# Altium schematic sheet USB.SchDoc
size A; SheetNumber: 2; SheetTotal: 13
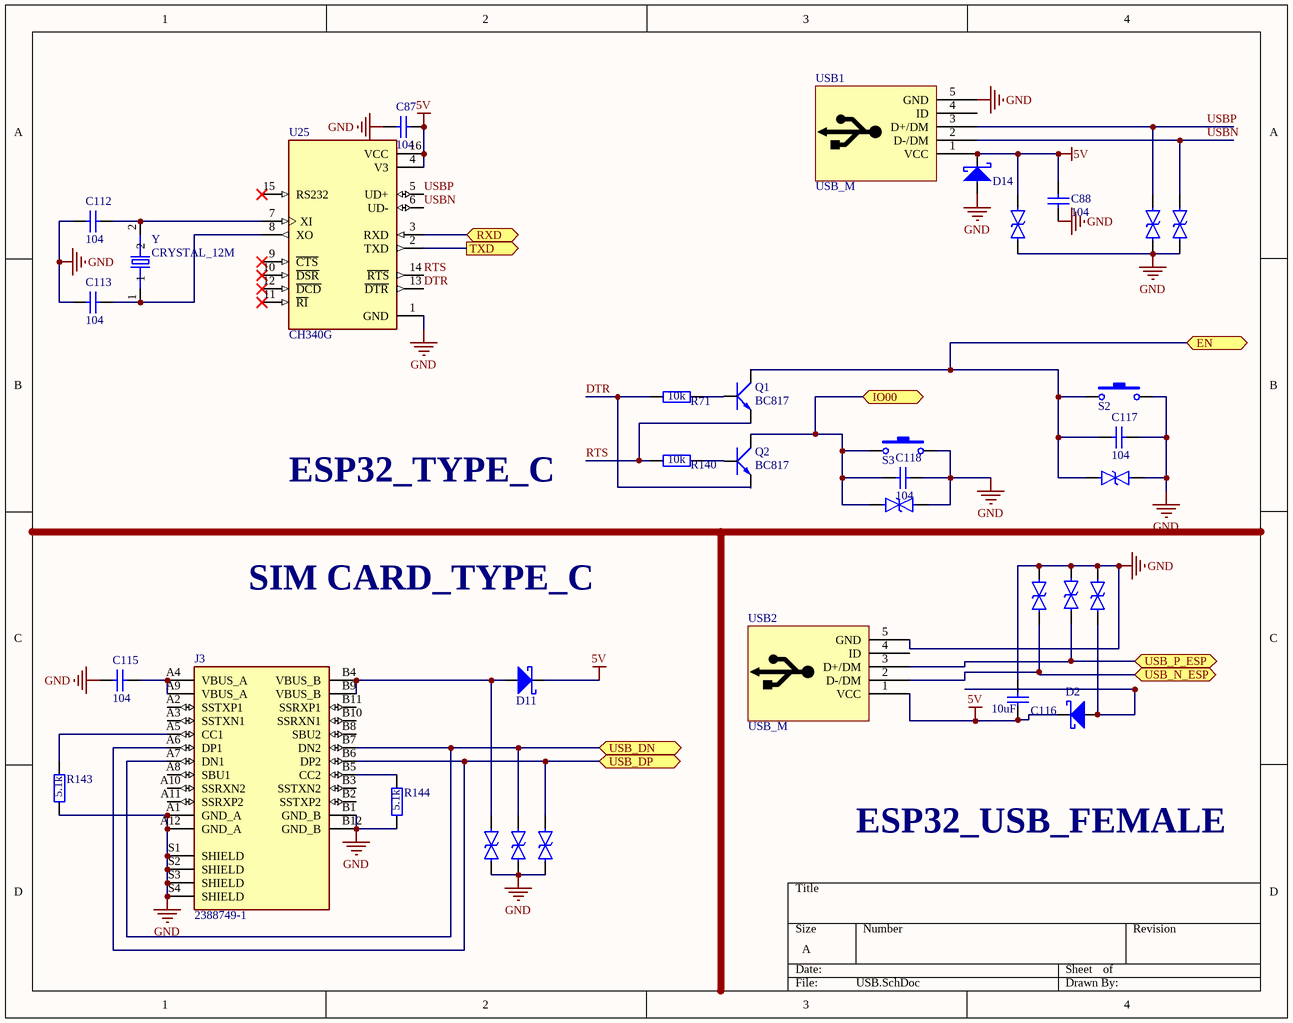
[diagram p0: USB.SchDoc]

## Parts
C87  104  [0603_Cap]
C88  104  [0603_Cap]
C112  104  [0603_Cap]
C113  104  [0603_Cap]
C115  104  [0603_Cap]
C116  10uF  [1206_CAP]
C117  104  [0603_Cap]
C118  104  [0603_Cap]
D2  SS24  [DIO-SMD-106]  (value not drawn)
D11  SS24  [DIO-SMD-106]  (value not drawn)
D14  SS24  [DIO-SMD-106]  (value not drawn)
J3  2388749-1  [USBC]
Q1  BC817  [SOT-23]
Q2  BC817  [SOT-23]
R71  10k  [0603_Res]
R140  10k  [0603_Res]
R143  5.1k  [0603_Res]
R144  5.1k  [0603_Res]
S2  SW  [BUTTON-SMD 2PIN]  (value not drawn)
S3  SW  [BUTTON-SMD 2PIN]  (value not drawn)
TVS5  SMBJ12CA  [SMB - DO-214AA]  (value not drawn)
TVS6  SMBJ12CA  [SMB - DO-214AA]  (value not drawn)
TVS9  SMBJ12CA  [SMB - DO-214AA]  (value not drawn)
TVS10  SMBJ12CA  [SMB - DO-214AA]  (value not drawn)
TVS11  SMBJ12CA  [SMB - DO-214AA]  (value not drawn)
TVS12  SMBJ12CA  [SMB - DO-214AA]  (value not drawn)
TVS18  SMBJ12CA  [SMB - DO-214AA]  (value not drawn)
TVS19  SMBJ12CA  [SMB - DO-214AA]  (value not drawn)
TVS20  SMBJ12CA  [SMB - DO-214AA]  (value not drawn)
TVS26  SMBJ12CA  [SMB - DO-214AA]  (value not drawn)
TVS27  SMBJ12CA  [SMB - DO-214AA]  (value not drawn)
U25  CH340G  [SOIC127P600X180-16N]
USB1  USB_M  [USB-M1]
USB2  USB_M  [USB-M1]
Y  CRYSTAL_12M  [XTAL1170X500X450]

## Ports
EN (bidir), IO00 (bidir), RXD (bidir), TXD (out), USB_DN (bidir), USB_DP (bidir), USB_N_ESP (bidir), USB_P_ESP (bidir)

## Nets
5V: C87.2 C88.1 C116.2 D2.2 D11.2 D14.2 TVS5.2 U25.4(V3) U25.16(VCC) USB1.1(VCC) USB2.1(VCC)
GND: C87.1 C88.2 C112.2 C113.2 C115.1 C116.1 C117.1 C118.1 D14.1 J3.A1(GND_A) J3.A12(GND_A) J3.B1(GND_B) J3.B12(GND_B) J3.S1(SHIELD) J3.S2(SHIELD) J3.S3(SHIELD) J3.S4(SHIELD) R143.1 R144.1 S2.2 S3.2 TVS5.1 TVS6.1 TVS9.1 TVS10.1 TVS11.1 TVS12.1 TVS18.1 TVS19.1 TVS20.1 TVS26.1 TVS27.1 U25.1(GND) USB1.5(GND) USB2.5(GND)
DTR: Q2.2(E) R71.1 U25.13(~{DTR})
EN: C117.2 Q1.3(C) S2.1 TVS26.2 ; port EN
IO00: C118.2 Q2.3(C) S3.1 TVS27.2 ; port IO00
RTS: Q1.2(E) R140.1 U25.14(~{RTS})
RXD: U25.3(RXD) ; port RXD
TXD: U25.2(TXD) ; port TXD
USB_DN: J3.A7(DN1) J3.B7(DN2) TVS19.2 ; port USB_DN
USB_DP: J3.A6(DP1) J3.B6(DP2) TVS20.2 ; port USB_DP
USB_N_ESP: TVS10.2 USB2.2(D-/DM) ; port USB_N_ESP
USB_P_ESP: TVS11.2 USB2.3(D+/DM) ; port USB_P_ESP
USBN: TVS9.2 U25.6(UD-) USB1.2(D-/DM)
USBP: TVS6.2 U25.5(UD+) USB1.3(D+/DM)
NetC112_1: C112.1 U25.7(XI) Y.2
NetC113_1: C113.1 U25.8(XO) Y.1
NetC115_2: C115.2 J3.A4(VBUS_A) J3.A9(VBUS_A)
NetD2_1: D2.1 TVS12.2
NetD11_1: D11.1 J3.B4(VBUS_B) J3.B9(VBUS_B) TVS18.2
NetJ3_A5: J3.A5(CC1) R143.2
NetJ3_B5: J3.B5(CC2) R144.2
NetQ1_1: Q1.1(B) R71.2
NetQ2_1: Q2.1(B) R140.2

Not connected (* = marked no-connect by the designer): J3 A2(SSTXP1) A3(SSTXN1) A8(SBU1) A10(SSRXN2) A11(SSRXP2) B2(SSTXP2) B3(SSTXN2) B8(SBU2) B10(SSRXN1) B11(SSRXP1); U25 9(~{CTS})* 10(~{DSR})* 11(~{RI})* 12(~{DCD})* 15(RS232)*; USB1 4(ID); USB2 4(ID)

## Notes on the sheet
- ESP32_TYPE_C
- SIM CARD_TYPE_C
- ESP32_USB_FEMALE

## Library data of the parts
C87 C88 C112 C113 C115-C118 = Ceramic Capacitor: Chung_Loai: Dán; Don_Vi: Con; So_Chan: 2; Ten_Linh_Kien: Tụ 0805 104-100nF 10% 50V; Ma_Hang: MH004551; Kieu_Chan: *
D2 D11 D14 = Diode Schottky: Part Number: LED 3 ly Single Colour; Pricing: *
J3 = 2388749-1: USB-C (USB TYPE-C) USB 4.0 Receptacle Connector 24 Position Surface Mount, Right Angle; Through Hole; MF: TE Connectivity; Value: *; SnapEDA_Link: https://www.snapeda.com/parts/2388749-1/TE+Connectivity/view-part/?ref=snap; Purchase-URL: https://pricing.snapeda.com/search/part/2388749-1/?ref=eda; Availability: In Stock; Price: None; Package: None; Check_prices: https://www.snapeda.com/parts/2388749-1/TE+Connectivity/view-part/?ref=eda; MP: 2388749-1
Q1 Q2 = Trans BC817: SOT-23 - C8658; Value: C9014
R71 R140 R143 R144 = Resistor: Chung_Loai: Dán; Don_Vi: Con; So_Chan: 2; Ten_Linh_Kien: Trở 0805 1% 1k; Ma_Hang: MH005468; Kieu_Chan: *
S2 S3 = SW-Button: Switch-Button; Published: 24-Mar-1999; LatestRevisionDate: 17-Jul-2002; LatestRevisionNote: Re-released for DXP Platform.; PackageReference: SPST-2; Publisher: Altium Limited
TVS5 TVS6 TVS9-TVS12 TVS18-TVS20 TVS26 TVS27 = TVS Bi Diode
U25 = CH340G: USB Interface Integrated Circuit; MF: WCH; Value: *; SnapEDA_Link: https://www.snapeda.com/parts/Ch340G/WCH/view-part/?ref=snap; MP: Ch340G; Check_prices: https://www.snapeda.com/parts/Ch340G/WCH/view-part/?ref=eda; Availability: Not in stock; Price: None; Package: None
Y = CRYSTAL_12M: HC49SDLF Series 12.288 MHz Â±30 ppm 20 pF -20 to +70 Â°C Resistance Weld Crystal; MF: Fox Electronics; MP: FOXSDLF/128-20/TR; Price: None; Package: None; Availability: Unavailable; Value: *; SnapEDA_Link: https://www.snapeda.com/parts/FOXSDLF/128-20/TR/Fox%20Electronics/view-part/1118363/?ref=snap